# Altium schematic sheet SuiveurLigne7.SchDoc: =NomDeProjet
size Letter; Author: AC/KC; Engineer: k.cotton; Organization: Cegep Limoilou; Address1: 1300, 8e Avenue; Address2: Québec, QC; Address3: Canada; Address4: G1J 5L5; SheetNumber: 1; SheetTotal: 1
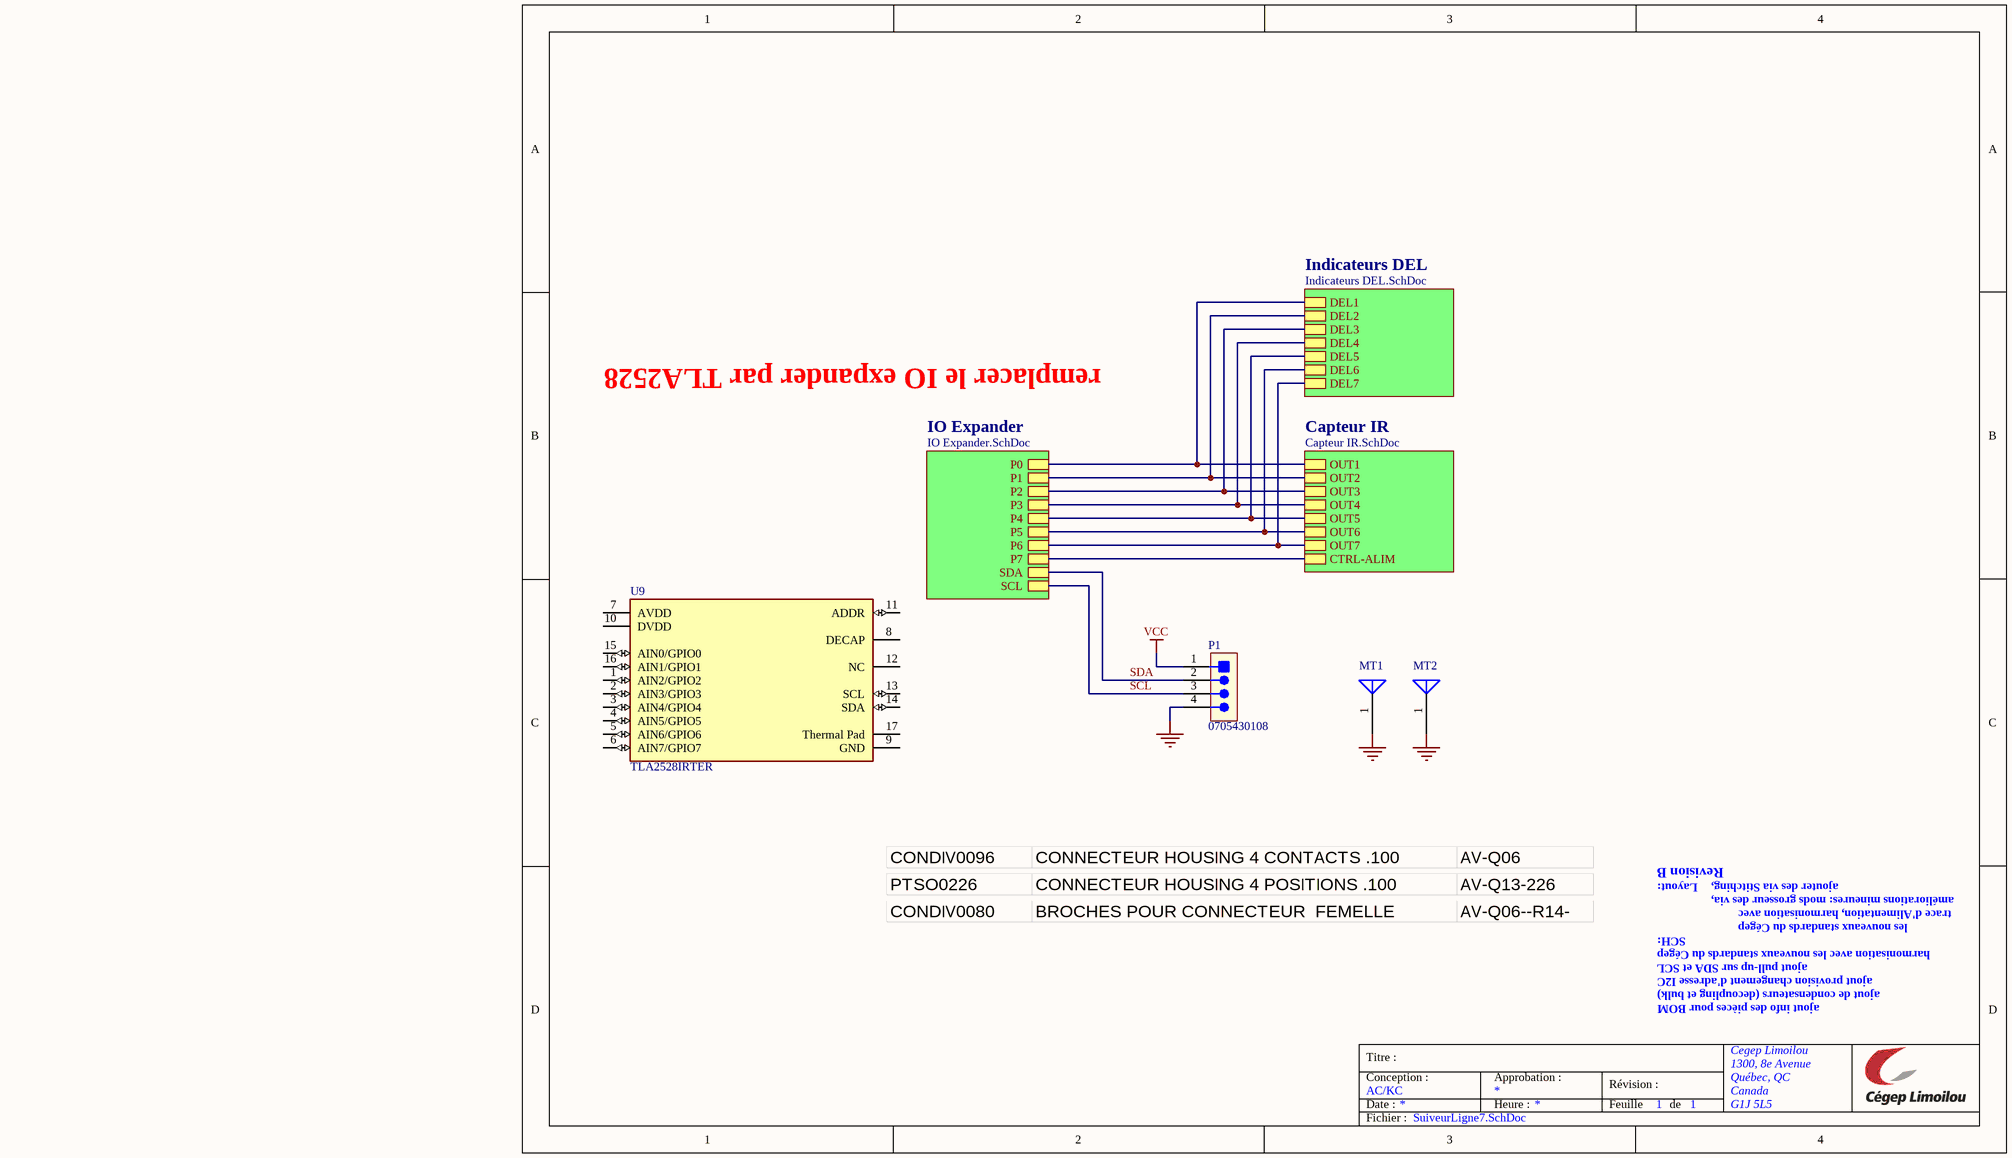
[diagram p0: SuiveurLigne7.SchDoc]

## Parts
MT1  (no value)  [MTHOLE]  (no BOM)
MT2  (no value)  [MTHOLE]  (no BOM)
P1  0705430108  [MOLEX4]
U9  TLA2528IRTER  [FP-TLA2528IRTER-MFG]

## Sub-sheets
Capteur IR = Capteur IR.SchDoc: OUT1, OUT2, OUT3, OUT4, OUT5, OUT6, OUT7, CTRL-ALIM
Indicateurs DEL = Indicateurs DEL.SchDoc: DEL1, DEL2, DEL3, DEL4, DEL5, DEL6, DEL7
IO Expander = IO Expander.SchDoc: P0, P1, P2, P3, P4, P5, P6, P7, SCL, SDA

## Nets
GND: MT1.1 MT2.1 P1.4
VCC: P1.1
SCL: P1.3 ; sheet IO Expander/SCL
SDA: P1.2 ; sheet IO Expander/SDA
(unnamed): sheet Capteur IR/OUT1, sheet Indicateurs DEL/DEL1, sheet IO Expander/P0
(unnamed): sheet Capteur IR/OUT2, sheet Indicateurs DEL/DEL2, sheet IO Expander/P1
(unnamed): sheet Capteur IR/OUT3, sheet Indicateurs DEL/DEL3, sheet IO Expander/P2
(unnamed): sheet Capteur IR/OUT4, sheet Indicateurs DEL/DEL4, sheet IO Expander/P3
(unnamed): sheet Capteur IR/OUT5, sheet Indicateurs DEL/DEL5, sheet IO Expander/P4
(unnamed): sheet Capteur IR/OUT6, sheet Indicateurs DEL/DEL6, sheet IO Expander/P5
(unnamed): sheet Capteur IR/OUT7, sheet Indicateurs DEL/DEL7, sheet IO Expander/P6
(unnamed): sheet Capteur IR/CTRL-ALIM, sheet IO Expander/P7

Not connected (* = marked no-connect by the designer): U9 1(AIN2/GPIO2) 2(AIN3/GPIO3) 3(AIN4/GPIO4) 4(AIN5/GPIO5) 5(AIN6/GPIO6) 6(AIN7/GPIO7) 7(AVDD) 8(DECAP) 9(GND) 10(DVDD) 11(ADDR) 12(NC) 13(SCL) 14(SDA) 15(AIN0/GPIO0) 16(AIN1/GPIO1) 17(Thermal_Pad)

## Notes on the sheet
- remplacer le IO expander par TLA2528
- Revision B
- Layout:
- ajouter des via Stitching,
- améliorations mineures: mods grosseur des via,
- SCH:
- harmonisation avec les nouveaux standards du Cégep
- ajout pull-up sur SDA et SCL
- trace d'Alimentation, harmonisation avec
- les nouveaux standards du Cégep
- ajout provision changement d'adresse I2C
- ajout de condensateurs (decoupling et bulk)
- ajout info des pièces pour BOM
- Titre :
- Conception :
- Date :
- Approbation :
- Heure :
- Révision :
- Feuille
- de
- Fichier :

## Library data of the parts
MT1 MT2 = ANTENNA
P1 = CONN-100MIL-HDR-01X04-WIRE-TO-BORAD: CONN HEADER VERT 4POS 2.54MM; Manufacturer 1: CJT; Manufacturer Part Number 1: A2547WV-4P; Code CEGEP: CONDIV089; Localisation: AV-Q06--R14-J057; Supplier 1: LCSC; Supplier Part Number 1: C5224497; Manufacturer 2: Molex; Manufacturer Part Number 2: 0705430108; Supplier 2: Digikey; Supplier Part Number 2: WM4124-ND; Mounting Technology: TH
U9 = CMP-04860-000031-1: SMALL 8-CHANNEL 12-BIT ANALOG-TO; RoHS Compliant: Yes